# EAGLE design energyMonitor_v1 (EAGLE 5.10)
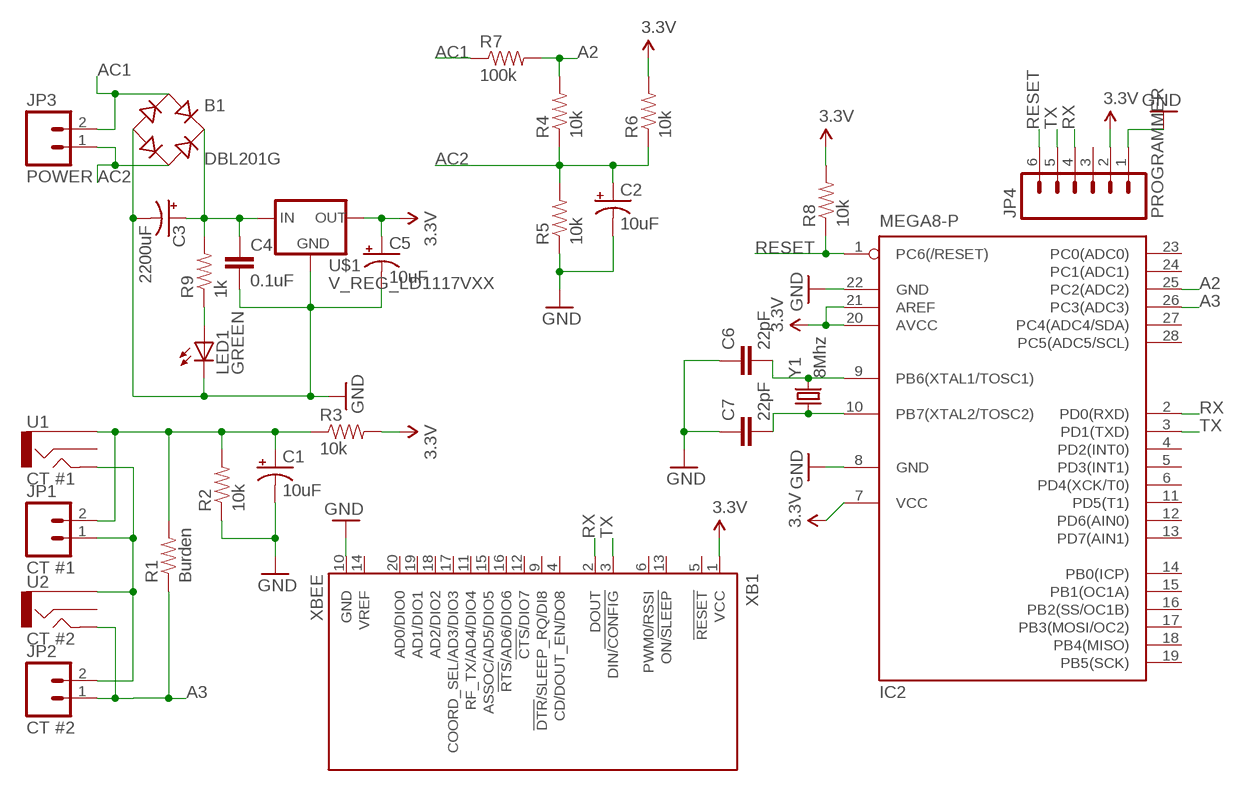
[diagram p0: schematic, sheet 1]

## Parts
B1  DBL201G  [DB]
C1  10uF  CAP_POLPTH2  [CPOL-RADIAL-10UF-25V]
C2  10uF  CAP_POLPTH2  [CPOL-RADIAL-10UF-25V]
C3  2200uF  CAP_POLPTH4  [CPOL-RADIAL-1000UF-25V]
C4  0.1uF  CAPPTH  [CAP-PTH-SMALL]
C5  10uF  CAP_POLPTH2  [CPOL-RADIAL-10UF-25V]
C6  22pF  CAPPTH  [CAP-PTH-SMALL]
C7  22pF  CAPPTH  [CAP-PTH-SMALL]
IC2  MEGA8-P  [DIL28-3]
JP1  CT #1  M023.5MM-NO_SILK  [SCREWTERMINAL-3.5MM-2-NS]
JP2  CT #2  M023.5MM-NO_SILK  [SCREWTERMINAL-3.5MM-2-NS]
JP3  POWER  M023.5MM-NO_SILK  [SCREWTERMINAL-3.5MM-2-NS]
JP4  PROGRAMMER  M06SIP  [1X06]
LED1  GREEN  LED5MM  [LED5MM]
R1  Burden  RESISTORPTH-1/4W  [AXIAL-0.4]
R2  10k  RESISTORPTH-1/4W  [AXIAL-0.4]
R3  10k  RESISTORPTH-1/4W  [AXIAL-0.4]
R4  10k  RESISTORPTH-1/4W  [AXIAL-0.4]
R5  10k  RESISTORPTH-1/4W  [AXIAL-0.4]
R6  10k  RESISTORPTH-1/4W  [AXIAL-0.4]
R7  100k  RESISTORPTH-1/4W  [AXIAL-0.4]
R8  10k  RESISTORPTH-1/4W  [AXIAL-0.4]
R9  1k  RESISTORPTH-1/4W  [AXIAL-0.4]
U1  CT #1  AUDIO-JACKPTH  [AUDIO-JACK]
U2  CT #2  AUDIO-JACKPTH  [AUDIO-JACK]
U$1  V_REG_LD1117VXX  [78XXL]
XB1  XBEE  [XBEE]
Y1  8Mhz  CRYSTALHC49US  [HC49US]

## Nets
3.3V: C5.1(+) IC2.7(VCC) IC2.20(AVCC) IC2.21(AREF) JP4.2 R3.P$2 R6.P$2 R8.P$2 U$1.GND(OUT) XB1.1(VCC)
A2: IC2.25(PC2(ADC2)) R4.P$2 R7.P$2
A3: IC2.26(PC3(ADC3)) JP2.1 R1.P$1 U2.5
AC1: B1.AC1 JP3.2 R7.P$1
AC2: B1.AC2 C2.1(+) JP3.1 R4.P$1 R5.P$2 R6.P$1
GND: B1.- C1.2(-) C2.2(-) C3.2(-) C4.2 C5.2(-) C6.1 C7.1 IC2.8(GND) IC2.22(GND) JP4.1 LED1.K(C) R2.P$1 R5.P$1 U$1.IN(GND) XB1.10(GND)
N$3: C1.1(+) JP1.2 R1.P$2 R2.P$2 R3.P$1 U1.1
N$4: B1.+ C3.1(+) C4.1 R9.P$2 U$1.OUT(IN)
N$5: LED1.A R9.P$1
N$7: C6.2 IC2.9(PB6(XTAL1/TOSC1)) Y1.2
N$8: C7.2 IC2.10(PB7(XTAL2/TOSC2)) Y1.1
N$11: JP1.1 JP2.2 U1.5 U2.1
RESET: IC2.1(PC6(/RESET)) JP4.6 R8.P$1
RX: IC2.2(PD0(RXD)) JP4.4 XB1.2(DOUT)
TX: IC2.3(PD1(TXD)) JP4.5 XB1.3(DIN/!CONFIG)
Unconnected: IC2.4(PD2(INT0)) IC2.5(PD3(INT1)) IC2.6(PD4(XCK/T0)) IC2.11(PD5(T1)) IC2.12(PD6(AIN0)) IC2.13(PD7(AIN1)) IC2.14(PB0(ICP)) IC2.15(PB1(OC1A)) IC2.16(PB2(SS/OC1B)) IC2.17(PB3(MOSI/OC2)) IC2.18(PB4(MISO)) IC2.19(PB5(SCK)) IC2.23(PC0(ADC0)) IC2.24(PC1(ADC1)) IC2.27(PC4(ADC4/SDA)) IC2.28(PC5(ADC5/SCL)) JP4.3 U1.2 U2.2 XB1.4(CD/DOUT_EN/DO8) XB1.5(!RESET) XB1.6(PWM0/RSSI) XB1.9(!DTR!/SLEEP_RQ/DI8) XB1.11(RF_TX/AD4/DIO4) XB1.12(!CTS!/DIO7) XB1.13(ON/!SLEEP) XB1.14(VREF) XB1.15(ASSOC/AD5/DIO5) XB1.16(!RTS!/AD6/DIO6) XB1.17(COORD_SEL/AD3/DIO3) XB1.18(AD2/DIO2) XB1.19(AD1/DIO1) XB1.20(AD0/DIO0)

## Library data of the parts
B1 = rectifier:DB?*G: Single Phase 1.0 AMP Glass Passivated Bridge Rectifier Taiwan Semiconductor Co.,Ltd. - TSC Source: http://www.taiwansemi.com/TSCbig5/ezcatfiles/cust/img/img/db101g.pdf http://www.ts.com.tw/db/pictures/modules/PDT/PDT060207001/DBLS201G.pdf
C1-C3 C5 = SparkFun:CAP_POL: Capacitor Polarized These are standard SMD and PTH capacitors. Normally 10uF, 47uF, and 100uF in electrolytic and tantalum varieties. Always verify the external diameter of the through hole cap, it varies with capacity, voltage, and manufacturer. The EIA devices should be standard.
C4 C6 C7 = SparkFun:CAP: Capacitor Standard 0603 ceramic capacitor, and 0.1" leaded capacitor.
IC2 = atmel:MEGA8-P: MICROCONTROLLER 8 Kbytes FLASH, 1 kbytes SRAM, 512 bytes EEPROM, USART, 4-channel 10 bit ADC, 2-channel 8 bit ADC Pin compatible with Atmega48, ATMega88, ATMega168 Source: avr.lbr
JP1-JP3 = SparkFun:M02: Header 2 Standard 2-pin 0.1" header. Use with straight break away headers (SKU : PRT-00116), right angle break away headers (PRT-00553), swiss pins (PRT-00743), machine pins (PRT-00117), and female headers (PRT-00115). Molex polarized connector foot print use with SKU : PRT-08233 with associated crimp pins and housings.
JP4 = SparkFun:M06: Header 6 Standard 6-pin 0.1" header. Use with straight break away headers (SKU : PRT-00116), right angle break away headers (PRT-00553), swiss pins (PRT-00743), machine pins (PRT-00117), and female headers (PRT-00115). Molex polarized connector foot print use with SKU : PRT-08094 with associated crimp pins and housings. NOTES ON THE VARIANTS LOCK and LOCK_LONGPADS... This footprint was designed to help hold the alignment of a through-hole component (i.e. 6-pin header) while soldering it into place. You may notice that each hole has been shifted either up or down by 0.005 of an inch from it's more standard position (which is a perfectly straight line). This slight alteration caused the pins (the squares in the middle) to touch the edges of the holes. Because they are alternating, it causes a "brace" to hold the component in place. 0.005 has proven to be the perfect amount of "off-center" position when using our standard breakaway headers. Although looks a little odd when you look at the bare footprint, once you have a header in there, the alteration is very hard to notice. Also, if you push a header all the way into place, it is covered up entirely on the bottom side. This idea of altering the position of holes to aid alignment will be further integrated into the Sparkfun Library for other footprints. It can help hold any component with 3 or more connection pins.
LED1 = SparkFun:LED: LEDs Standard schematic elements and footprints for 5mm, 3mm, 1206, and 0603 sized LEDs. 5mm - Spark Fun Electronics SKU : COM-00529 (and others)
R1-R9 = SparkFun:RESISTOR: Resistor Basic schematic elements and footprints for 0603, 1206, and PTH resistors.
U1 U2 = SparkFun:AUDIO-JACK: 3.5mm Audio Jack Simple 3.5mm common PCB mount audio jack. SKU: PRT-08032
U$1 = SparkFun:V_REG_LD1117VXX: LD1117VXX voltage regulator. We carry the 3.3V version (COM-00526) in TO-220 package.
XB1 = maxstream:XBEE: XBee (TM) /XBee-PRO(TM) OEM RF Modules Source: MaxStream, Inc. xbee_productmanual.pdf
Y1 = SparkFun:CRYSTAL: Crystals Various standard crystals. Proven footprints. Spark Fun Electronics SKU : COM-00534

## Board
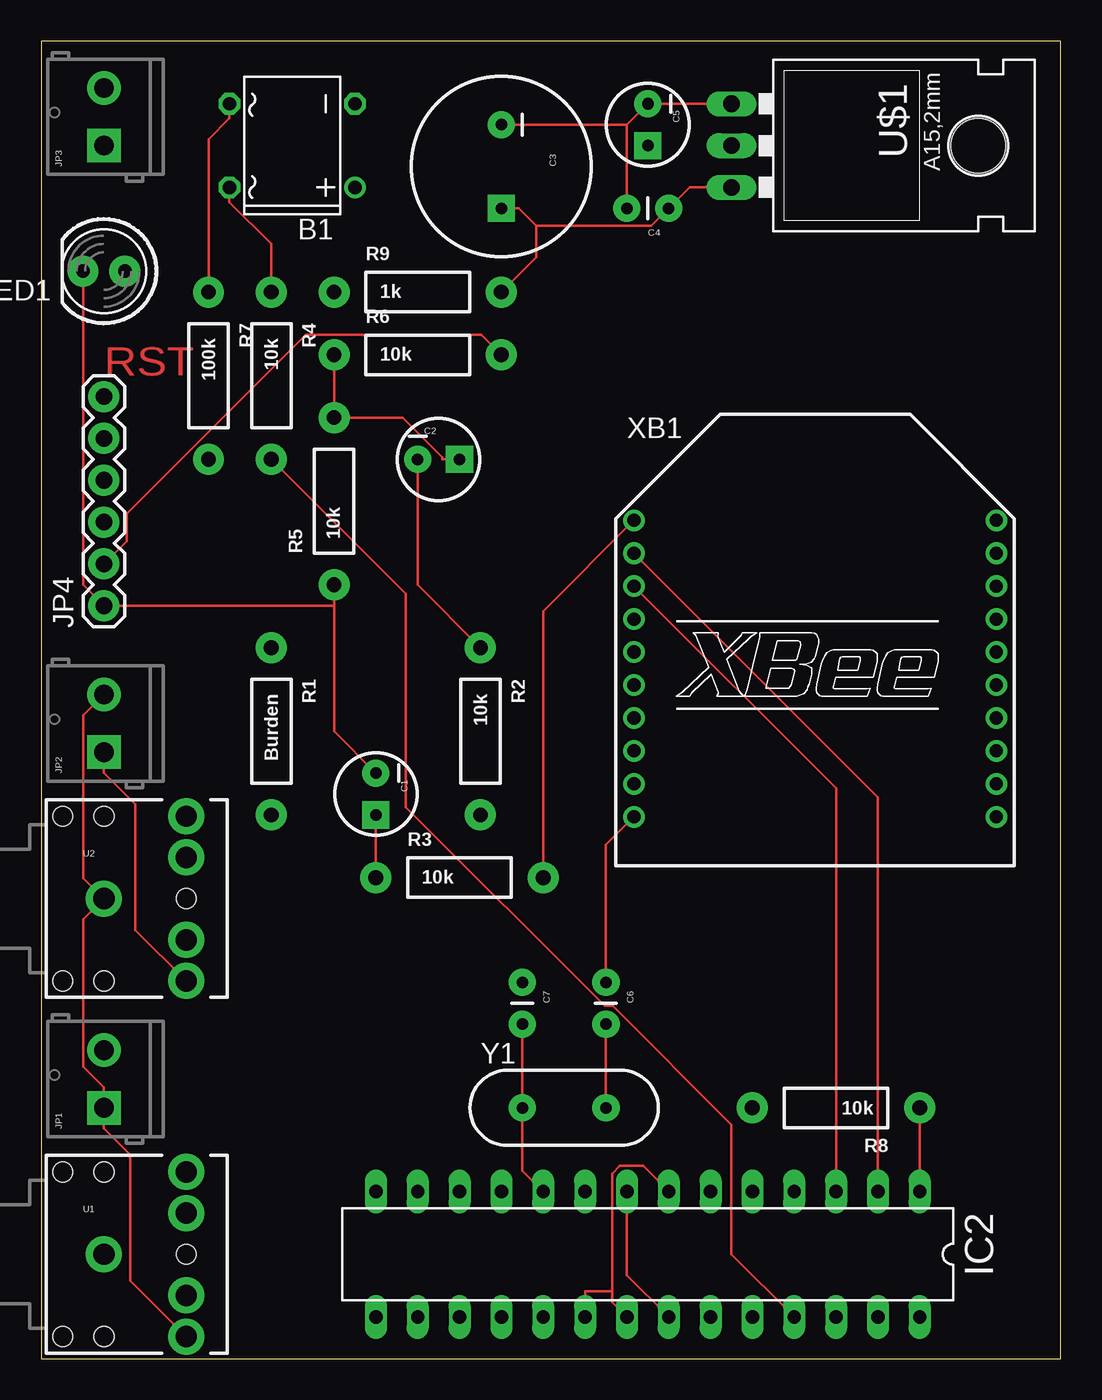
[diagram p1: board, top side]
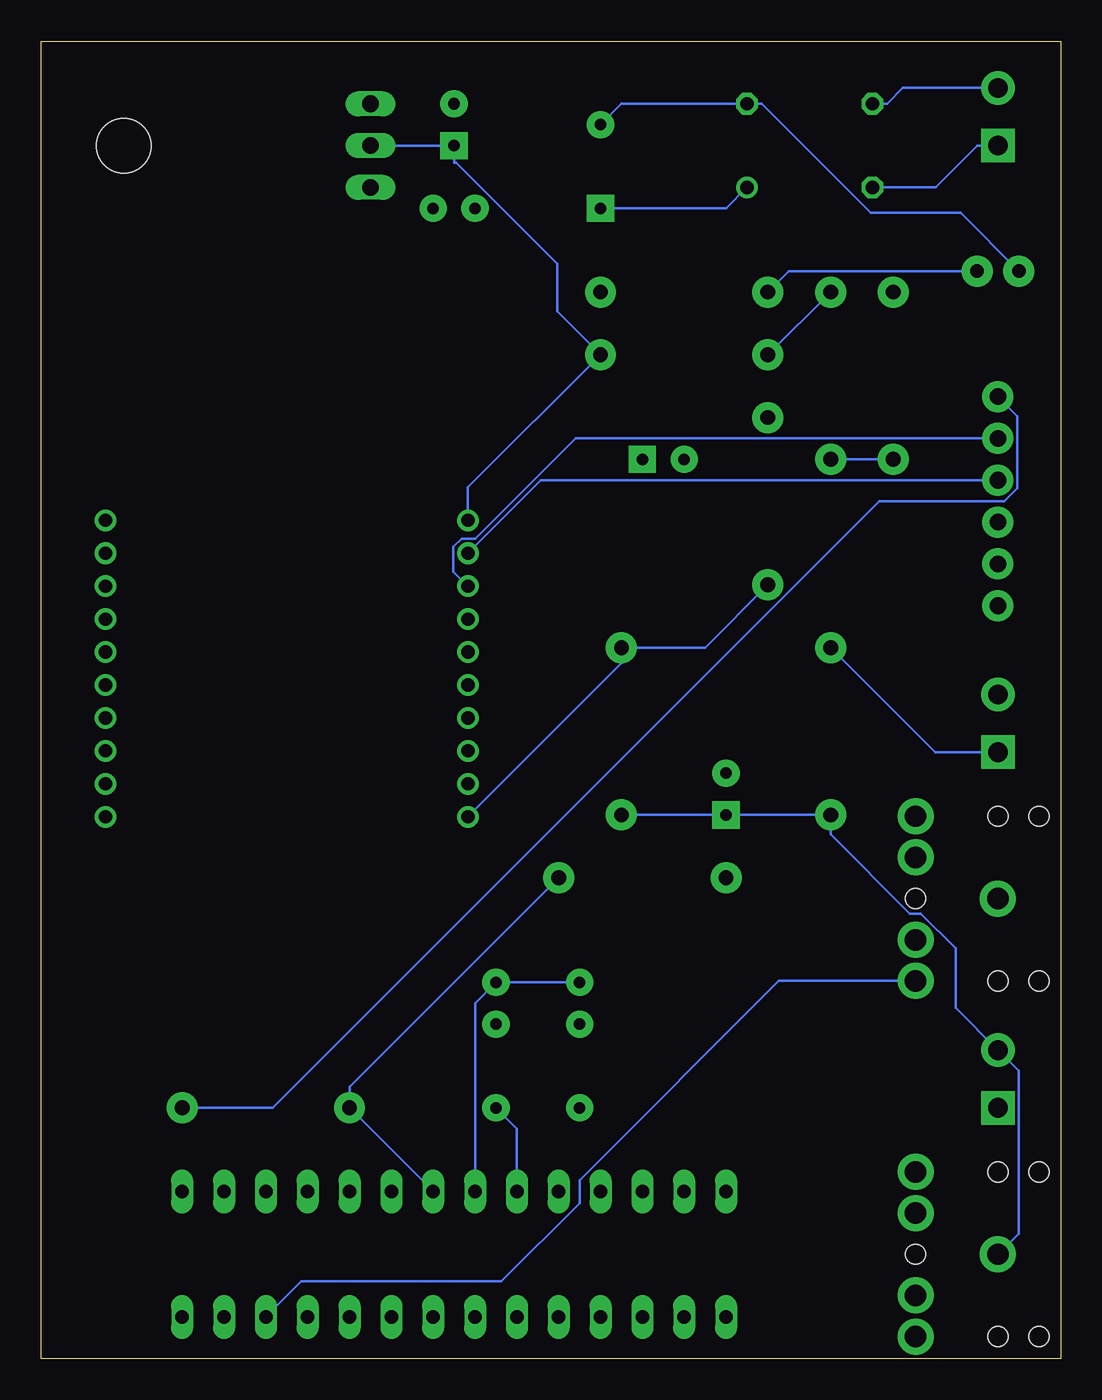
[diagram p2: board, bottom side, seen from below]

Size 61.9 x 80 mm. Coordinates in mm from the lower left corner, seen from the top.
Outline: 0,0 61.9,0 61.9,80 0,80 0,0
Copper layers (1*16): Top 0.035mm / dielectric 1.5mm / Bottom 0.035mm
Design rules "ITead_rule": minimum track width 6mil, minimum drill 12mil, track to track 6mil, track to pad 6mil, pad to pad 6mil, via to via 6mil, smd to smd 0mil, copper to edge 10mil, drill to drill 10mil, minimum pad ring 10mil, minimum via ring 6mil, stop-mask expansion 2mil, vias tented up to drill 100mil, thermal gap 10mil

### Footprints (pad centres in the part's own frame; a part is rotated, then mirrored left to right if it is on the bottom)
DB = drill 0.813 round: + -2.54,-3.81 | drill 0.813 octagon: - 2.54,-3.81; AC1 2.54,3.81; AC2 -2.54,3.81
CPOL-RADIAL-10UF-25V = drill 0.7 pad 1.651 square: 1 1.27,0 | drill 0.7 pad 1.651 round: 2 -1.27,0
CPOL-RADIAL-1000UF-25V = drill 0.7 pad 1.651 square: 1 2.54,0 | drill 0.7 pad 1.651 round: 2 -2.54,0
CAP-PTH-SMALL = drill 0.7 pad 1.651 round: 1 0,0; 2 2.54,0
DIL28-3 = drill 0.813 long: 1 -16.51,-3.81; 2 -13.97,-3.81; 3 -11.43,-3.81; 4 -8.89,-3.81; 5 -6.35,-3.81; 6 -3.81,-3.81; 7 -1.27,-3.81; 8 1.27,-3.81; 9 3.81,-3.81; 10 6.35,-3.81; 11 8.89,-3.81; 12 11.43,-3.81; 13 13.97,-3.81; 14 16.51,-3.81; 15 16.51,3.81; 16 13.97,3.81; 17 11.43,3.81; 18 8.89,3.81; 19 6.35,3.81; 20 3.81,3.81; 21 1.27,3.81; 22 -1.27,3.81; 23 -3.81,3.81; 24 -6.35,3.81; 25 -8.89,3.81; 26 -11.43,3.81; 27 -13.97,3.81; 28 -16.51,3.81
SCREWTERMINAL-3.5MM-2-NS = drill 1.2 pad 2.032 square: 1 0,0 | drill 1.2 pad 2.032 round: 2 3.5,0
1X06 = drill 1.016 pad 1.88 round: 1 0,0; 2 2.54,0; 3 5.08,0; 4 7.62,0; 5 10.16,0; 6 12.7,0
LED5MM = drill 0.813 pad 1.88 round: A -1.27,0; K 1.27,0
AXIAL-0.4 = drill 0.9 pad 1.88 round: P$1 -5.08,0; P$2 5.08,0
AUDIO-JACK = drill 1.3 pad 2.184 round: 1 0,0; 2 5,5; 3 5,2.5; 4 5,-2.5; 5 5,-5 | hole 1.2: 0,5; -2.5,5; -2.5,-5; 0,-5; 5,0
78XXL = drill 1.016 long: GND 0,-3.81; IN -2.54,-3.81; OUT 2.54,-3.81 | hole 3.302: 0,11.176
XBEE = drill 0.8 pad 1.27 round: 1 -11,9; 2 -11,7; 3 -11,5; 4 -11,3; 5 -11,1; 6 -11,-1; 7 -11,-3; 8 -11,-5; 9 -11,-7; 10 -11,-9; 11 11,-9; 12 11,-7; 13 11,-5; 14 11,-3; 15 11,-1; 16 11,1; 17 11,3; 18 11,5; 19 11,7; 20 11,9
HC49US = drill 0.7 pad 1.651 round: 1 -2.54,0; 2 2.54,0

### Placement (x,y rotation side)
B1  15.24,73.66 90 top
C1  20.32,34.29 270 top
C2  24.13,54.61 0 top
C3  27.94,72.39 270 top
C4  38.1,69.85 180 top
C5  36.83,74.93 270 top
C6  34.29,22.86 270 top
C7  29.21,22.86 270 top
IC2  36.83,6.35 180 top
JP1  3.81,15.24 90 top
JP2  3.81,36.83 90 top
JP3  3.81,73.66 90 top
JP4  3.81,45.72 90 top
LED1  3.81,66.04 180 top
R1  13.97,38.1 270 top
R2  26.67,38.1 270 top
R3  25.4,29.21 0 top
R4  13.97,59.69 270 top
R5  17.78,52.07 90 top
R6  22.86,60.96 0 top
R7  10.16,59.69 270 top
R8  48.26,15.24 180 top
R9  22.86,64.77 0 top
U1  3.81,6.35 0 top
U2  3.81,27.94 0 top
U$1  45.72,73.66 270 top
XB1  46.99,41.91 0 top
Y1  31.75,15.24 0 top

### Tracks (layer width: path | path; a pad name or v marks a point on that pad's centre or on a via)
3.3V
  Top 0.152: 34.67,4.09 34.67,3.43 IC2.21 | IC2.7 36.55,11.71 35.13,11.71 34.67,11.25 34.67,4.09 | 34.67,4.09 33.02,4.09 IC2.20 | XB1.1 30.48,45.4 R3.P$2 | R6.P$2 26.72,62.18 16.07,62.18 5.18,51.3 5.18,49.63 JP4.2
  Bottom 0.152: XB1.1 35.99,52.91 R6.P$2 30.58,63.6 30.58,66.49 36.7,72.61 36.83,72.61 C5.1 40.16,73.66 U$1.GND | R3.P$2 43.18,16.51 R8.P$2 IC2.7
A2
  Top 0.152: R4.P$2 22.14,46.44 22.14,33.49 34.21,21.42 34.71,21.42 41.91,14.22 41.91,6.35 IC2.25
  Bottom 0.152: R4.P$2 R7.P$2
A3
  Top 0.152: JP2.1 3.81,35.59 5.72,33.68 5.72,26.03 U2.5
  Bottom 0.152: U2.5 17.11,22.94 29.21,10.84 29.21,9.44 33.95,4.7 46.1,4.7 IC2.26 | R1.P$1 7.62,36.83 JP2.1
AC1
  Top 0.152: B1.AC1 11.43,75.31 10.16,74.04 R7.P$1
  Bottom 0.152: B1.AC1 10.54,76.2 9.58,77.16 JP3.2
AC2
  Top 0.152: B1.AC2 11.43,70.23 13.97,67.69 R4.P$1 | C2.1 24.35,54.61 24.35,54.74 21.94,57.15 R5.P$2 R6.P$1
  Bottom 0.152: JP3.1 5.05,73.66 7.59,71.12 B1.AC2 | R6.P$1 R4.P$1
GND
  Top 0.152: 35.56,74.93 C5.2 40.16,76.2 U$1.IN | XB1.10 34.29,31.21 C6.1 | IC2.22 35.56,5.08 IC2.8 | 35.56,74.93 C4.2 | C3.2 35.56,74.93 | 17.78,45.72 17.78,38.1 C1.2 | R5.P$1 17.78,45.72 | 17.78,45.72 JP4.1 2.54,46.99 LED1.K | C2.2 22.86,46.99 R2.P$1
  Bottom 0.152: LED1.K 6.08,69.58 11.54,69.58 18.16,76.2 B1.- 26.67,76.2 C3.2 | C7.1 C6.1 35.56,21.59 IC2.8 | XB1.10 26.67,42.23 R2.P$1 21.59,43.18 R5.P$1
N$3
  Top 0.152: C1.1 R3.P$1
  Bottom 0.152: U1.1 2.56,7.6 2.56,17.49 JP1.2 6.38,21.31 6.38,24.92 8.49,27.03 9.17,27.03 13.97,31.83 R1.P$2 19.27,33.02 C1.1 R2.P$2
N$4
  Top 0.152: U$1.OUT 39.37,71.12 C4.1 37.05,68.8 30.05,68.8 | 30.05,68.8 28.99,69.85 C3.1 | 30.05,68.8 30.05,66.88 R9.P$2
  Bottom 0.152: C3.1 20.32,69.85 B1.+
N$5
  Bottom 0.152: R9.P$1 16.51,66.04 LED1.A
N$7
  Top 0.152: Y1.2 C6.2
  Bottom 0.152: Y1.2 33.02,13.97 IC2.9
N$8
  Top 0.152: IC2.10 29.21,11.43 Y1.1 C7.2
N$11
  Top 0.152: JP2.2 2.56,39.08 2.56,29.19 U2.1 2.56,26.7 2.56,17.73 3.81,16.48 JP1.1 3.81,13.99 5.42,12.38 5.42,4.74 U1.5
RESET
  Top 0.152: R8.P$1 IC2.1
  Bottom 0.152: R8.P$1 47.84,15.24 11.01,52.07 3.42,52.07 2.62,52.87 2.62,57.23 JP4.6
RX
  Top 0.152: XB1.2 50.8,34.1 IC2.2
  Bottom 0.152: JP4.4 31.56,53.34 XB1.2
TX
  Top 0.152: XB1.3 48.26,34.64 IC2.3
  Bottom 0.152: XB1.3 36.87,47.79 36.87,49.3 36.38,49.8 35.54,49.8 29.46,55.88 JP4.5

### Text on the board
Top: RST